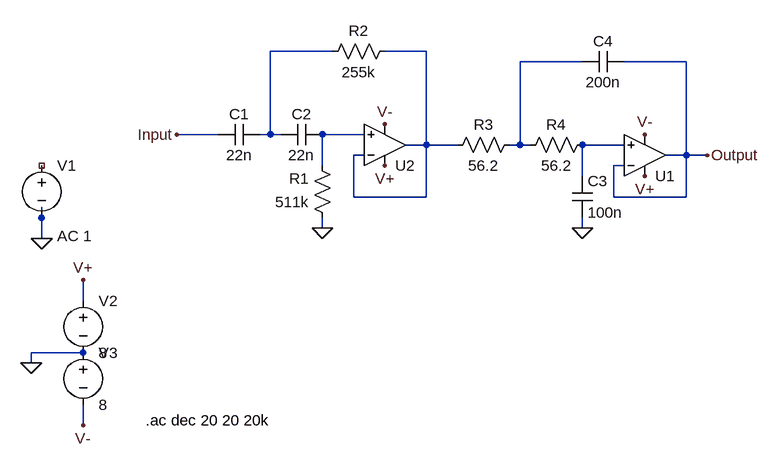
[diagram p0: schematic bandpass.asc]
bandpass.asc, the LTspice schematic file:
Version 4
SHEET 1 880 680
WIRE 160 32 64 32
WIRE 304 32 240 32
WIRE 544 48 448 48
WIRE 704 48 608 48
WIRE -16 160 -80 160
WIRE 64 160 64 32
WIRE 64 160 48 160
WIRE 80 160 64 160
WIRE 208 160 144 160
WIRE 304 176 304 32
WIRE 304 176 272 176
WIRE 352 176 304 176
WIRE 448 176 448 48
WIRE 448 176 432 176
WIRE 464 176 448 176
WIRE 608 176 544 176
WIRE 208 192 192 192
WIRE 704 192 704 48
WIRE 704 192 672 192
WIRE 736 192 704 192
WIRE 144 208 144 160
WIRE 608 208 592 208
WIRE 544 224 544 176
WIRE 192 256 192 192
WIRE 304 256 304 176
WIRE 304 256 192 256
WIRE 592 256 592 208
WIRE 704 256 704 192
WIRE 704 256 592 256
WIRE -288 288 -288 272
WIRE 144 304 144 288
WIRE 544 304 544 288
WIRE -288 320 -288 288
WIRE -224 416 -224 384
WIRE -224 496 -304 496
WIRE -304 512 -304 496
WIRE -224 608 -224 576
FLAG 144 304 0
FLAG 544 304 0
FLAG -288 320 0
FLAG -304 512 0
FLAG -224 384 V+
FLAG 240 208 V+
FLAG 640 224 V+
FLAG -224 608 V-
FLAG 640 160 V-
FLAG 240 144 V-
FLAG -80 160 Input
FLAG 736 192 Output
SYMBOL cap 48 144 R90
WINDOW 0 0 32 VBottom 2
WINDOW 3 32 32 VTop 2
SYMATTR InstName C1
SYMATTR Value 22n
SYMBOL cap 144 144 R90
WINDOW 0 0 32 VBottom 2
WINDOW 3 32 32 VTop 2
SYMATTR InstName C2
SYMATTR Value 22n
SYMBOL res 160 304 R180
WINDOW 0 36 76 Left 2
WINDOW 3 36 40 Left 2
SYMATTR InstName R1
SYMATTR Value 511k
SYMBOL res 144 48 R270
WINDOW 0 32 56 VTop 2
WINDOW 3 0 56 VBottom 2
SYMATTR InstName R2
SYMATTR Value 255k
SYMBOL res 448 160 R90
WINDOW 0 0 56 VBottom 2
WINDOW 3 32 56 VTop 2
SYMATTR InstName R3
SYMATTR Value 56.2
SYMBOL res 560 160 R90
WINDOW 0 0 56 VBottom 2
WINDOW 3 32 56 VTop 2
SYMATTR InstName R4
SYMATTR Value 56.2
SYMBOL cap 528 224 R0
SYMATTR InstName C3
SYMATTR Value 100n
SYMBOL cap 608 32 R90
WINDOW 0 0 32 VBottom 2
WINDOW 3 32 32 VTop 2
SYMATTR InstName C4
SYMATTR Value 200n
SYMBOL voltage -288 192 R0
WINDOW 123 24 124 Left 2
WINDOW 39 0 0 Left 0
SYMATTR Value2 AC 1
SYMATTR InstName V1
SYMATTR Value ""
SYMBOL OpAmps\\UniversalOpAmp 640 192 M180
SYMATTR InstName U1
SYMBOL OpAmps\\UniversalOpAmp 240 176 M180
SYMATTR InstName U2
SYMBOL voltage -224 400 R0
WINDOW 123 0 0 Left 0
WINDOW 39 0 0 Left 0
SYMATTR InstName V2
SYMATTR Value 8
SYMBOL voltage -224 480 R0
WINDOW 123 0 0 Left 0
WINDOW 39 0 0 Left 0
SYMATTR InstName V3
SYMATTR Value 8
TEXT -128 600 Left 2 !.ac dec 20 20 20k

The netlist it stands for:
* bandpass.asc
C1 N001 Input 22n
C2 N004 N001 22n
R1 0 N004 511k
R2 N001 N002 255k
R3 N003 N002 56.2
R4 N005 N003 56.2
C3 N005 0 100n
C4 Output N003 200n
V1 NC_01 0 AC 1
XU1 N005 Output V+ V- Output level1 Avol=1Meg GBW=10Meg Vos=0 En=0 Enk=0 In=0 Ink=0 Rin=500Meg  ; pins In+ In- V+ V- OUT
XU2 N004 N002 V+ V- N002 level1 Avol=1Meg GBW=10Meg Vos=0 En=0 Enk=0 In=0 Ink=0 Rin=500Meg  ; pins In+ In- V+ V- OUT
V2 V+ 0 8
V3 0 V- 8
.ac dec 20 20 20k
.lib UniversalOpAmp1.lib
.backanno
.end